# Altium schematic sheet MainSchematic.SchDoc
size A4
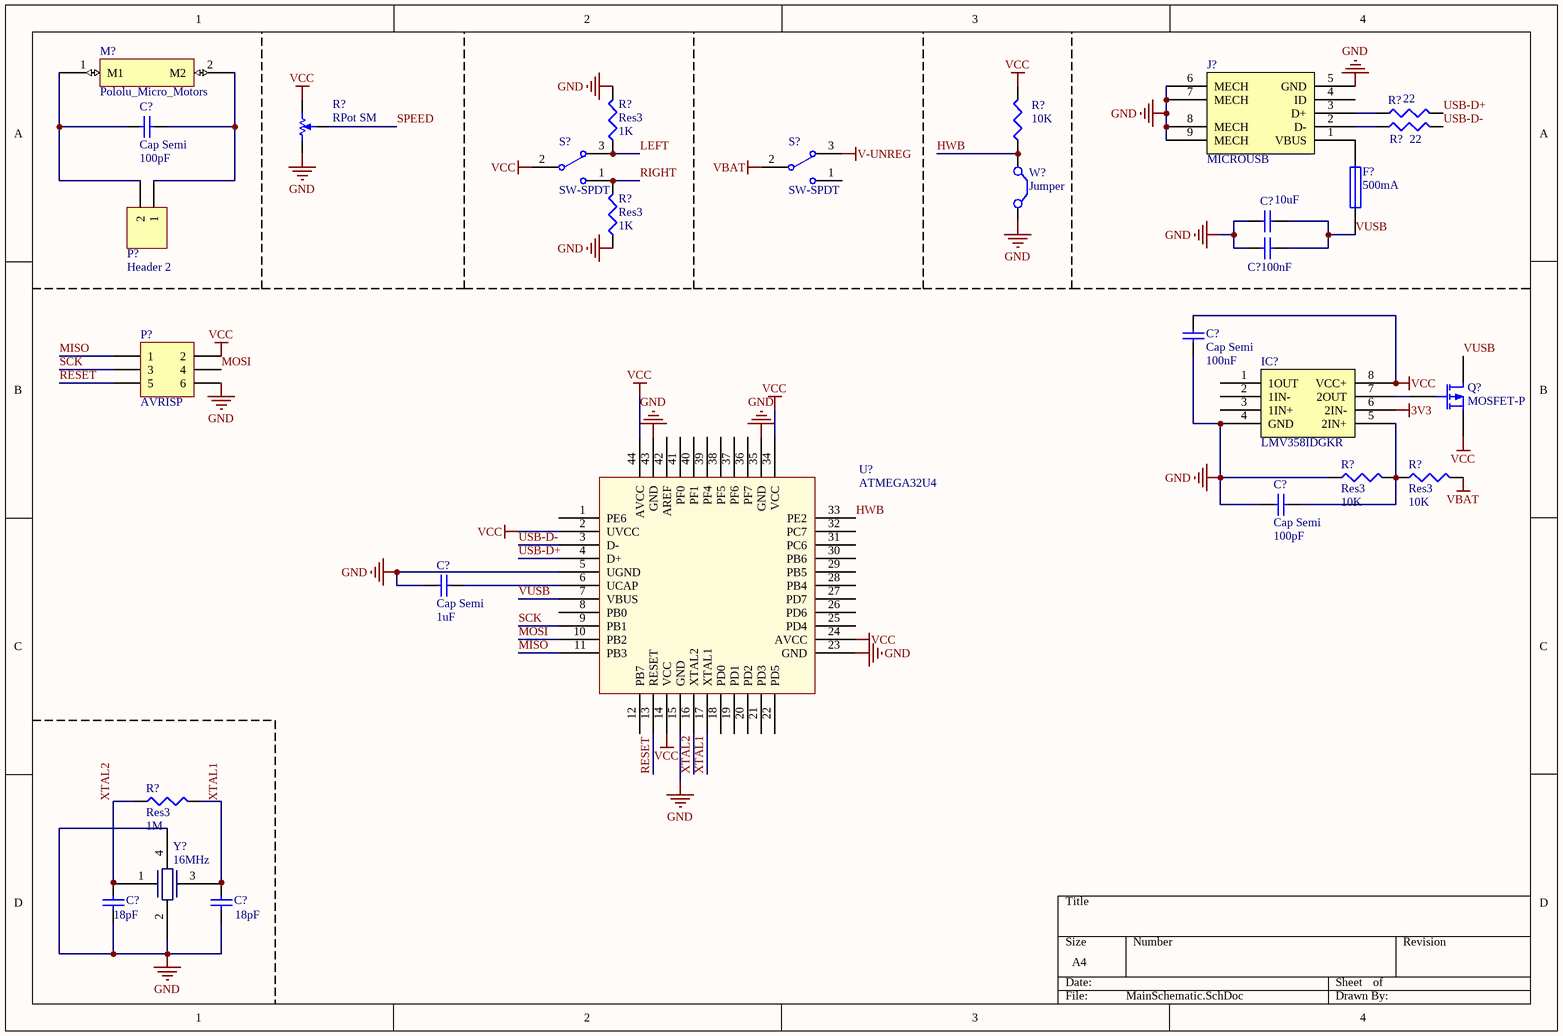
[diagram p0: MainSchematic.SchDoc]

## Parts
(Parts that share a designator on the sheet are numbered #1, #2 ... from top to bottom, then left to right.)
C?#1  Cap Semi  value 100pF  [1608[0603]]
C?#2  value 10uF  [1608[0603]]  (hidden comment: Cap Semi)
C?#3  value 100nF  [1608[0603]]  (hidden comment: Cap Semi)
C?#4  Cap Semi  value 100nF  [1608[0603]]
C?#5  Cap Semi  value 100pF  [1608[0603]]
C?#6  Cap Semi  value 1uF  [1608[0603]]
C?#7  value 18pF  [1608[0603]]  (hidden comment: Cap Semi)
C?#8  value 18pF  [1608[0603]]  (hidden comment: Cap Semi)
F?  500mA  [RESC4532N]
IC?  LMV358IDGKR  [LMV358IDGKR]
J?  MICROUSB  [MicroUSB]
M?  Pololu_Micro_Motors  [PololuMicroMotor]
P?#1  Header 2  [HDR1X2]
P?#2  AVRISP  [HDR2X3]
Q?  MOSFET-P  [E3]
R?#1  RPot SM  [POT4MM-2]
R?#2  value 22  [J1-0603]  (hidden comment: Res3)
R?#3  value 22  [J1-0603]  (hidden comment: Res3)
R?#4  Res3  value 1K  [J1-0603]
R?#5  value 10K  [J1-0603]  (hidden comment: Res3)
R?#6  Res3  value 1K  [J1-0603]
R?#7  Res3  value 10K  [J1-0603]
R?#8  Res3  value 10K  [J1-0603]
R?#9  Res3  value 1M  [J1-0603]
S?#1  SW-SPDT  [POLOLU_MINI_SLIDE_SWITCH]
S?#2  SW-SPDT  [POLOLU_MINI_SLIDE_SWITCH]
U?  ATMEGA32U4  [ATMEGA32u4 - TQFP]
W?  Jumper  [RAD-0.2]
Y?  16MHz  [TXC XTAL 7B]

## Nets
3V3: IC?.6(2IN-)
GND: C?#2.1 C?#3.1 C?#4.1 C?#5.1 C?#6.1 C?#7.1 C?#8.1 IC?.4(GND) J?.5(GND) J?.6(MECH) J?.7(MECH) J?.8(MECH) J?.9(MECH) P?#2.6 R?#1.CCW(-) R?#4.2 R?#6.1 R?#7.1 U?.5(UGND) U?.15(GND) U?.23(GND) U?.35(GND) U?.43(GND) W?.2(C2) Y?.2(GND) Y?.4(GND)
V-UNREG: S?#2.3
VBAT: R?#8.2 S?#2.2
VCC: C?#4.2 IC?.8(VCC+) P?#2.2 Q?.3(S) R?#1.CW(+) R?#5.2 S?#1.2 U?.2(UVCC) U?.14(VCC) U?.24(AVCC) U?.34(VCC) U?.44(AVCC)
HWB: R?#5.1 U?.33(PE2) W?.1(C1)
LEFT: R?#4.1 S?#1.3
MISO: P?#2.1 U?.11(PB3)
MOSI: P?#2.4 U?.10(PB2)
RESET: P?#2.5 U?.13(RESET)
RIGHT: R?#6.2 S?#1.1
SCK: P?#2.3 U?.9(PB1)
SPEED: R?#1.W
USB-D+: R?#2.2 U?.4(D+)
USB-D-: R?#3.2 U?.3(D-)
VUSB: C?#2.2 C?#3.2 F?.1 Q?.1(D) U?.7(VBUS)
XTAL1: C?#8.2 R?#9.2 U?.17(XTAL1) Y?.3
XTAL2: C?#7.2 R?#9.1 U?.16(XTAL2) Y?.1
NetC?#1_1: C?#1.1 M?.1(M1) P?#1.2
NetC?#1_2: C?#1.2 M?.2(M2) P?#1.1
NetC?#5_2: C?#5.2 IC?.5(2IN+) R?#7.2 R?#8.1
NetC?#6_2: C?#6.2 U?.6(UCAP)
NetF?_2: F?.2 J?.1(VBUS)
NetIC?_7: IC?.7(2OUT) Q?.2(G)
NetJ?_2: J?.2(D-) R?#3.1
NetJ?_3: J?.3(D+) R?#2.1

Not connected (* = marked no-connect by the designer): IC? 1(1OUT) 2(1IN-) 3(1IN+); J? 4(ID); S?#2 1; U? 1(PE6) 8(PB0) 12(PB7) 18(PD0) 19(PD1) 20(PD2) 21(PD3) 22(PD5) 25(PD4) 26(PD6) 27(PD7) 28(PB4) 29(PB5) 30(PB6) 31(PC6) 32(PC7) 36(PF7) 37(PF6) 38(PF5) 39(PF4) 40(PF1) 41(PF0) 42(AREF)

## Library data of the parts
C?#1-C?#8 = Cap Semi: Capacitor (Semiconductor SIM Model); Published: 8-Jun-2000; LatestRevisionDate: 29-May-2009; LatestRevisionNote: IPC-7351 Footprint Added.; PackageReference: C1206; Publisher: Altium Limited; PackageDescription: Chip Capacitor
F? = Fuse 1: Fuse; Published: 8-Jun-2000; LatestRevisionDate: 17-Jul-2002; LatestRevisionNote: Re-released for DXP Platform.; PackageReference: PIN-W2/E2.8; Publisher: Altium Limited; PackageDescription: Thru-Hole; 2 Leads
P?#1 = Header 2: Header, 2-Pin; LatestRevisionDate: 17-Jul-2002; LatestRevisionNote: Re-released for DXP Platform.; Publisher: Altium Limited
P?#2 = Header 3X2: Header, 3-Pin, Dual row; LatestRevisionDate: 17-Jul-2002; LatestRevisionNote: Re-released for DXP Platform.; Publisher: Altium Limited
Q? = MOSFET-P: P-Channel MOSFET; Published: 8-Jun-2000; LatestRevisionDate: 17-Jul-2002; LatestRevisionNote: Re-released for DXP Platform.; PackageVersion: 1995/1996; PackageReference: E3; Publisher: Altium Limited; PackageDescription: TO, Flat Index; 3 In-Line, Axial Leads; Body Dia. 4.6mm; Lead Dia. 0.5 mm (max)
R?#1 = RPot SM: Square Trimming Potentiometer; Published: 17-Dec-2003; DatasheetVersion: Oct-2003; PackageReference: POT4MM-2; Publisher: Altium Limited; PackageDescription: Square Trimming Potentiometer; ComponentLink1Description: Manufacturer Link; ComponentLink1URL: http://bourns.com/2/search.html
R?#2-R?#9 = Res3: Resistor; Published: 8-Jun-2000; LatestRevisionDate: 29-May-2009; LatestRevisionNote: IPC-7351 Footprint Added.; PackageReference: J1-0603; Publisher: Altium Limited; PackageDescription: Chip Resistor
S?#1 S?#2 = SW-SPDT: SPDT Subminiature Toggle Switch, Right Angle Mounting, Vertical Actuation; Published: 24-Mar-1999; LatestRevisionDate: 17-Dec-2003; LatestRevisionNote: Schematic revised, PCB Footprint replaced.; DatasheetVersion: 05-Dec-2000; PackageReference: TL36WW15050; Publisher: Altium Limited; PackageDescription: Switch; 4 Leads; ComponentLink1Description: Manufacturer Link; ComponentLink1URL: http://www.apem.com
U? = ATMEGA32U4: ATMEGA32U4 - TQFP/QFN 44; Supplier 1: Farnell; Supplier Part Number 1: 1748525; Supplier 2: Digi-Key; Supplier Part Number 2: ATMEGA32U4RC-AURCT-ND
W? = Jumper: Jumper Wire; Published: 24-Mar-1999; LatestRevisionDate: 17-Jul-2002; LatestRevisionNote: Re-released for DXP Platform.; PackageReference: RAD-0.2; Publisher: Altium Limited; PackageDescription: Radial Cap, Thru-Hole; 2 Leads; 0.2 in Pin Spacing
Y? = XTAL-4pin